# EAGLE design untitled (EAGLE 9.6.2)
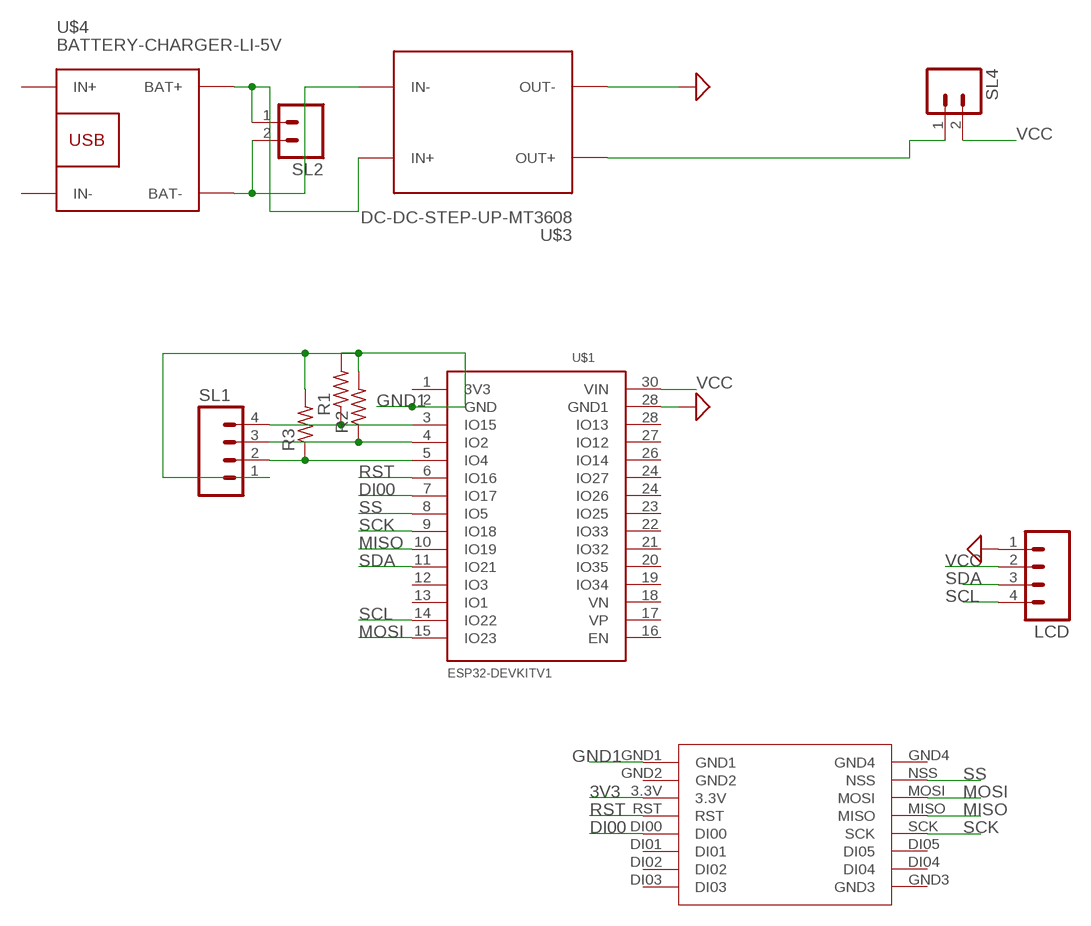
[diagram p0: schematic, sheet 1]

## Parts
LCD  M04  [04P]
R1  R-US_0207/10  [0207/10]
R2  R-US_0207/10  [0207/10]
R3  R-US_0207/10  [0207/10]
SL1  M04  [04P]
SL2  M02  [02P]
SL4  M02  [02P]
U$1  ESP32DEVKITV1  [ESP32-DEVKITV1]
U$2  LORASX1278  [LORASX1278]
U$3  DC-DC-STEP-UP-MT3608  [DC-DC-STEP-UP-MT3608]
U$4  BATTERY-CHARGER-LI-5V  [BATTERY-CHARGER-LI-5V]

## Nets
3V3: U$2.3.3V
DI00: U$1.7(IO17) U$2.DI00
GND: LCD.1 U$1.28(GND1) U$3.OUT- ; supply symbol labelled SUP
GND1: R1.2 R2.2 R3.2 SL1.1 U$1.2(GND) U$2.GND1
MISO: U$1.10(IO19) U$2.MISO
MOSI: U$1.15(IO23) U$2.MOSI
N$1: SL4.1 U$3.OUT+
N$2: SL2.2 U$3.IN- U$4.BAT-
N$3: R1.1 SL1.4 U$1.3(IO15)
N$4: R2.1 SL1.3 U$1.4(IO2)
N$5: SL2.1 U$3.IN+ U$4.BAT+
N$7: R3.1 SL1.2 U$1.5(IO4)
RST: U$1.6(IO16) U$2.RST
SCK: U$1.9(IO18) U$2.SCK
SCL: LCD.4 U$1.14(IO22)
SDA: LCD.3 U$1.11(IO21)
SS: U$1.8(IO5) U$2.NSS
VCC: LCD.2 SL4.2 U$1.30(VIN)
Unconnected: U$1.1(3V3) U$1.12(IO3) U$1.13(IO1) U$1.16(EN) U$1.17(VP) U$1.18(VN) U$1.19(IO34) U$1.20(IO35) U$1.21(IO32) U$1.22(IO33) U$1.23(IO25) U$1.24(IO26) U$1.24(IO27) U$1.26(IO14) U$1.27(IO12) U$1.28(IO13) U$2.DI01 U$2.DI02 U$2.DI03 U$2.DI04 U$2.DI05 U$2.GND2 U$2.GND3 U$2.GND4 U$4.IN+ U$4.IN-

## Library data of the parts
LCD SL1 = con-amp-quick:M04: AMP QUICK CONNECTOR; OC_FARNELL: unknown; OC_NEWARK: unknown
R1-R3 = adafruit:R-US_: RESISTOR, American symbol
SL2 SL4 = con-amp-quick:M02: AMP QUICK CONNECTOR; OC_FARNELL: unknown; OC_NEWARK: unknown
U$1 = ESP32-DEVKITV1:ESP32DEVKITV1
U$2 = sx1278:LORASX1278
U$3 = diy-modules:DC-DC-STEP-UP-MT3608: DC/DC Step-Up Regulator based on MT3608 chip MT3608 datasheet available here: https://www.olimex.com/Products/Breadboarding/BB-PWR-3608/resources/MT3608.pdf Click here to find device on ebay.com <http://www.ebay.com/sch/mt3608+module>
U$4 = diy-modules:BATTERY-CHARGER-LI-5V: Lithium Battery 5V Charger More details available here: http://www.buildcircuit.com/how-to-use-micro-usb-5v-1a-lithium-battery-charging-board-charger-module/ Click here to find device on ebay.com <http://www.ebay.com/sch/tp4056+charger+usb>

## Board
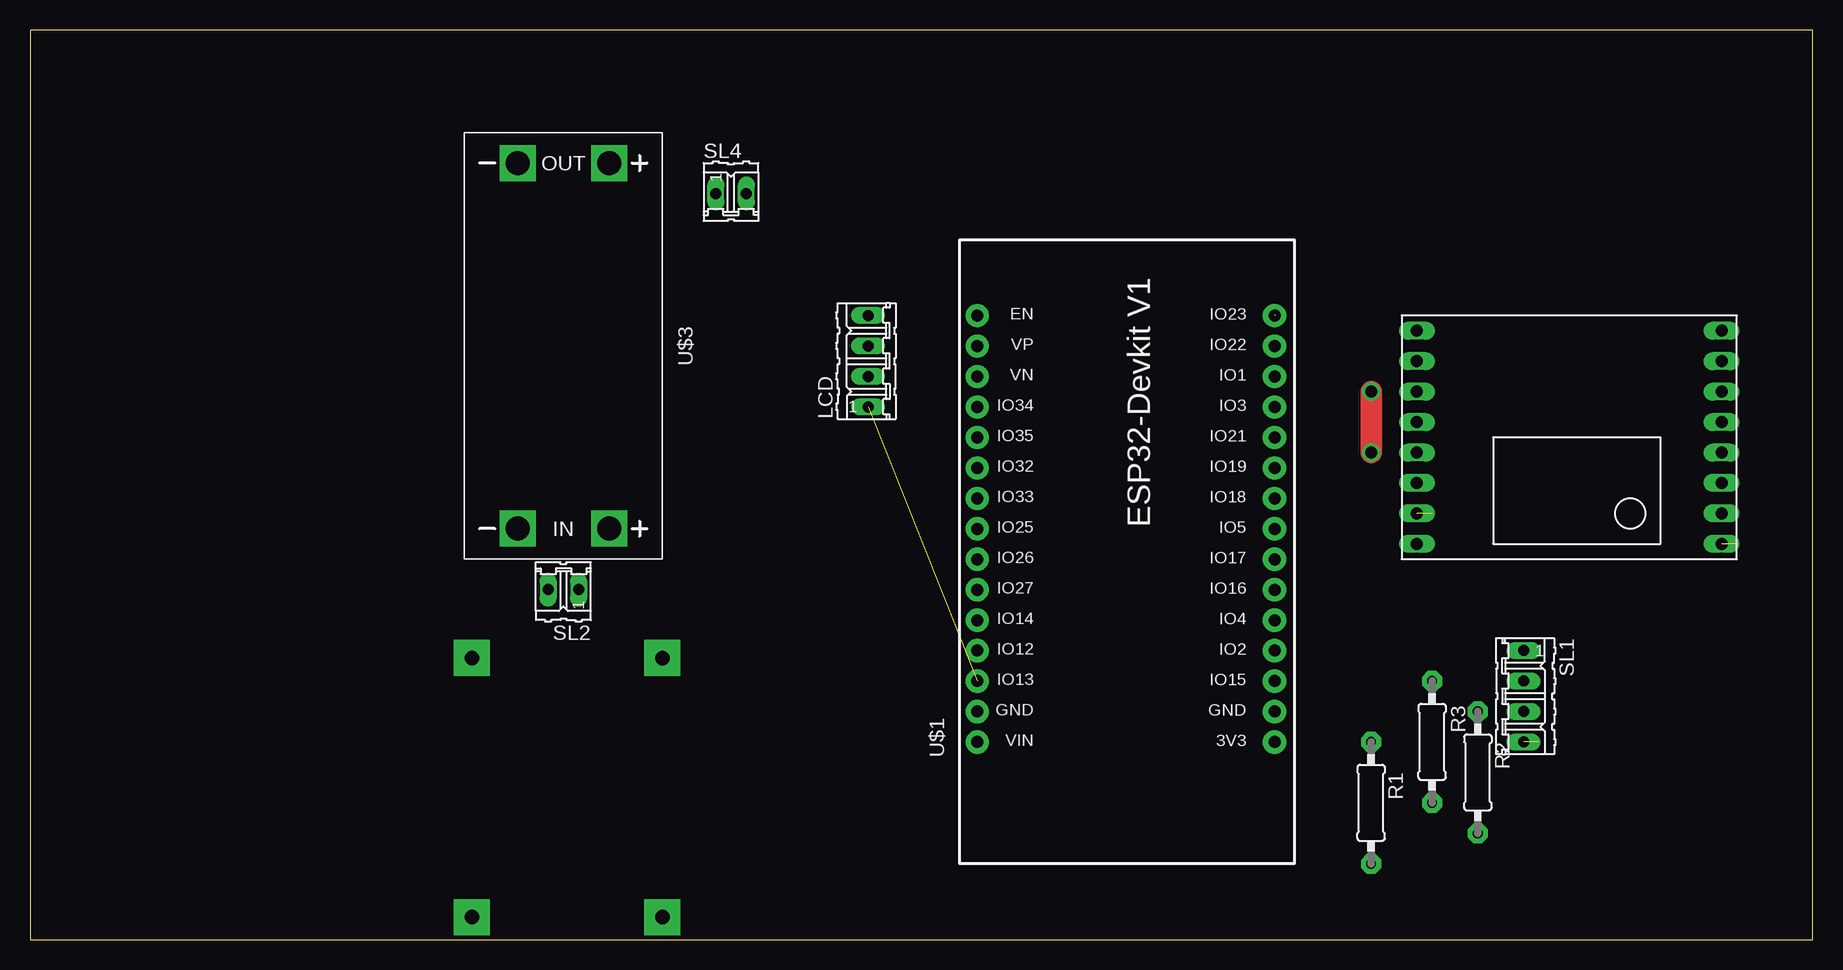
[diagram p1: board, top side]
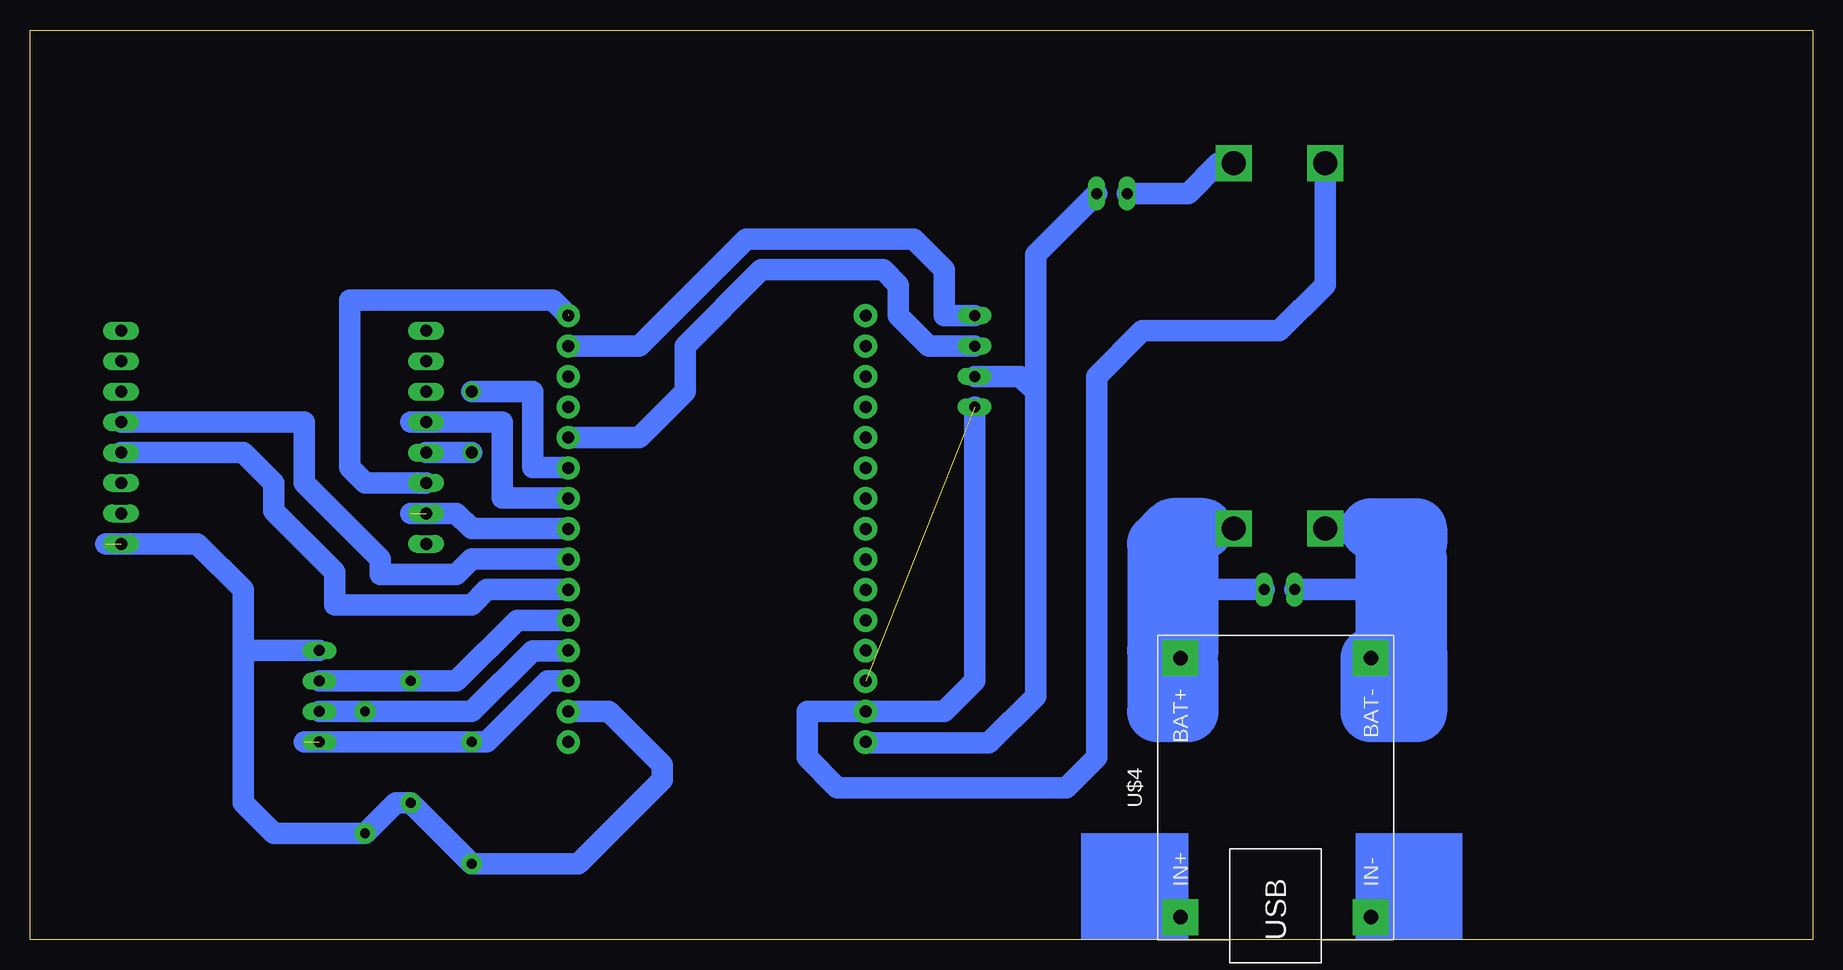
[diagram p2: board, bottom side, seen from below]

Size 148.57 x 75.87 mm. Coordinates in mm from the lower left corner, seen from the top.
Outline: 0,0 148.57,0 148.57,75.87 0,75.87 0,0
Copper layers (1*16): Top 0.035mm / dielectric 1.5mm / Bottom 0.035mm
Design rules "default *": minimum track width 6mil, minimum drill 0.35mm, track to track 30mil, track to pad 30mil, pad to pad 30mil, via to via 30mil, smd to smd 6mil, copper to edge 40mil, drill to drill 6mil, minimum pad ring 10mil, minimum via ring 8mil, stop-mask expansion 4mil, vias tented up to drill 0mil, thermal gap 10mil

### Footprints (pad centres in the part's own frame; a part is rotated, then mirrored left to right if it is on the bottom)
04P = drill 0.914 long: 1 -3.81,0; 2 -1.27,0; 3 1.27,0; 4 3.81,0
0207/10 = drill 0.813 pad 1.676 octagon: 1 -5.08,0; 2 5.08,0
02P = drill 0.914 long: 1 -1.27,0; 2 1.27,0
ESP32-DEVKITV1 = drill 1 pad 1.93: 1 -22.87,-13.54; 2 -20.33,-13.54; 3 -17.79,-13.54; 4 -15.25,-13.54; 5 -12.71,-13.54; 6 -10.17,-13.54; 7 -7.63,-13.54; 8 -5.09,-13.54; 9 -2.55,-13.54; 10 -0.01,-13.54; 11 2.53,-13.54; 12 5.07,-13.54; 13 7.61,-13.54; 14 10.15,-13.54; 15 12.69,-13.54; 16 12.69,11.23; 17 10.15,11.23; 18 7.61,11.23; 19 5.07,11.23; 20 2.53,11.23; 21 -0.01,11.23; 22 -2.55,11.23; 23 -5.09,11.23; 24 -7.63,11.23; 25 -10.17,11.23; 26 -12.71,11.23; 27 -15.25,11.23; 28 -17.79,11.23; 29 -20.33,11.23; 30 -22.87,11.23
LORASX1278 = drill 1 long: 3.3V -12.7,0; DI00 -12.7,-5.08; DI01 -12.7,-7.62; DI02 -12.7,-10.16; DI03 -12.7,-12.7; DI04 12.7,-10.16; DI05 12.7,-7.62; GND1 -12.7,5.08; GND2 -12.7,2.54; GND3 12.7,-12.7; GND4 12.7,5.08; MISO 12.7,-2.54; MOSI 12.7,0; NSS 12.7,2.54; RST -12.7,-2.54; SCK 12.7,-5.08
DC-DC-STEP-UP-MT3608 = drill 2 pad 2.8 square: IN+ 15.24,3.81; IN- 15.24,-3.81; OUT+ -15.24,3.81; OUT- -15.24,-3.81
BATTERY-CHARGER-LI-5V = drill 1.2 pad 3 square: BAT+ 10.795,8.255; BAT- 10.795,-7.62; IN+ -10.795,8.255; IN- -10.795,-7.62

### Placement (x,y rotation side)
LCD  69.85,48.26 90 top
R1  111.76,11.43 270 top
R2  120.65,13.97 270 top
R3  116.84,16.51 270 top
SL1  124.46,20.32 270 top
SL2  44.45,29.21 180 top
SL4  58.42,62.23 0 top
U$1  90.17,39.37 90 top
U$2  128.27,38.1 180 top
U$3  44.45,49.53 270 top
U$4  44.45,12.7 90 bottom

### Tracks (layer width: path | path; a pad name or v marks a point on that pad's centre or on a via)
DI00
  Bottom 1.778: U$1.7 111.76,31.75 113.03,30.48 119.38,30.48 119.38,31.75 125.73,38.1 125.73,43.18 U$2.DI00
GND  (1 unrouted)
  Bottom 1.778: U$3.OUT- 40.64,54.61 44.45,50.8 55.88,50.8 59.69,46.99 59.69,15.24 62.23,12.7 81.28,12.7 83.82,15.24 83.82,19.05 72.39,19.05 69.85,21.59 LCD.1
GND1  (1 unrouted)
  Bottom 1.778: 142.24,33.02 134.62,33.02 130.81,29.21 130.81,24.13 | U$1.2 100.34,19.04 100.33,19.05 95.88,14.61 95.88,13.33 102.87,6.35 R1.2 R3.2 118.11,11.43 R2.2 128.27,8.89 130.81,11.43 130.81,24.13 | SL1.1 130.81,24.13
MISO  (via drill 1)
  Top 1.778: v111.76,40.64 v111.76,45.72
  Bottom 1.778: U$2.MISO v111.76,40.64 | v111.76,45.72 106.68,45.72 106.68,39.37 U$1.10
MOSI  (1 unrouted)
  Bottom 1.778: U$2.MOSI 120.65,38.1 121.92,39.37 121.92,53.34 104.99,53.34 103.79,52.14 103.71,52.14
N$1
  Bottom 1.778: U$3.OUT+ 49.53,64.77 52.07,62.23 SL4.1
N$2
  Bottom 1.778: SL2.2 36.83,29.21
  Bottom 2.54: U$3.IN- 36.83,34.29 36.83,29.21 U$4.BAT-
  Bottom 5.08: 33.02,24.13 33.66,23.49 U$4.BAT- 36.83,19.05 33.02,19.05 33.02,24.13 | 33.02,24.13 33.02,31.75 34.29,33.02 | 36.83,34.29 33.02,34.29 33.02,33.02
N$3  (1 unrouted)
  Bottom 1.778: U$1.3 105.41,21.59 110.49,16.51 R1.1 125.73,16.51
N$4
  Bottom 1.778: U$1.4 106.69,24.12 111.76,19.05 R2.1 SL1.3
N$5
  Bottom 1.778: U$3.IN+ 49.53,34.29 50.8,33.02 52.07,33.02 52.07,30.48 50.8,29.21 SL2.1
  Bottom 2.54: U$3.IN+ 50.8,34.29
  Bottom 5.08: 50.8,34.29 53.34,34.29 | 53.34,34.29 54.61,33.02 54.61,24.13 | 54.61,24.13 53.97,23.49 U$4.BAT+ 52.07,24.13 52.07,33.02 53.34,34.29 | 54.61,24.13 54.61,19.05 52.07,19.05 52.07,22.86
N$7
  Bottom 1.778: U$1.5 107.96,26.66 113.03,21.59 SL1.2 R3.1
RST
  Bottom 1.778: U$1.6 110.49,29.21 111.76,27.94 123.19,27.94 123.19,30.7 128.27,35.78 128.27,38.1 130.81,40.64 U$2.RST
SCK
  Bottom 1.778: U$1.9 109.22,36.83 109.22,43.18 U$2.SCK 116.84,43.18
SCL
  Bottom 1.778: U$1.14 97.8,49.52 88.9,58.42 74.93,58.42 72.39,55.88 72.39,52.07 LCD.4
SDA
  Bottom 1.778: LCD.3 73.66,49.53 76.2,52.07 76.2,54.61 77.47,55.88 87.63,55.88 93.98,49.53 93.98,45.72 97.79,41.91 100.33,41.91 100.34,41.9 U$1.11
SS  (1 unrouted)
  Bottom 1.778: U$1.8 111.76,34.29 113.03,35.56 116.84,35.56
VCC
  Bottom 1.778: LCD.2 66.04,46.99 64.77,45.72 | 64.77,45.72 64.77,20.32 68.67,16.42 78.94,16.42 U$1.30 | SL4.2 64.77,57.15 64.77,45.72
(copper drawn outside any net)
  shapes: Bottom area x2